# Altium schematic sheet dmpro16-pcb-v1-MCU-GPIO.SchDoc
size A4; DocumentNumber: 12; SheetNumber: 12; SheetTotal: 17; SheetName: MCU-GPIO
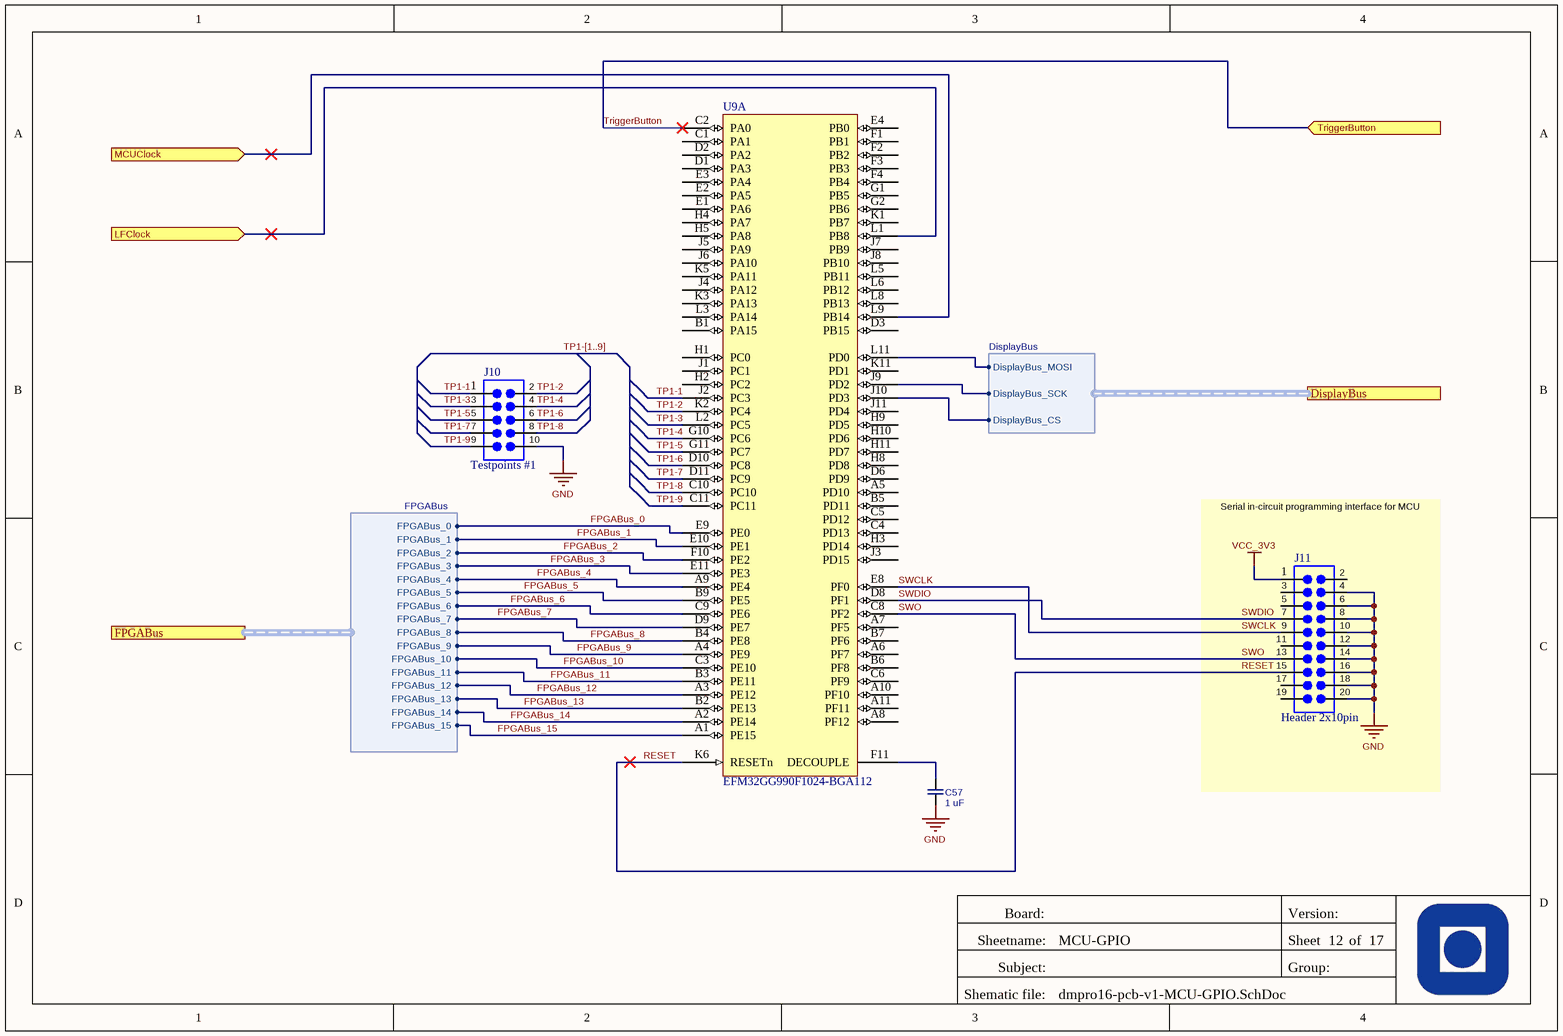
[diagram p0: dmpro16-pcb-v1-MCU-GPIO.SchDoc]

## Parts
C57  1 uF  [CAPC2012_0h50]
J10  Testpoints #1  [HEADER_2X5]
J11  Header 2x10pin  [HEADER_2X10]
U9  EFM32GG990F1024-BGA112  [ENMR-BGA112]  (part A of 2)

## Ports
DisplayBus (harness DisplayBus), FPGABus (harness FPGABus), LFClock (in), MCUClock (in), TriggerButton (in)

## Harnesses
DisplayBus: DisplayBus_MOSI, DisplayBus_SCK, DisplayBus_CS
FPGABus: FPGABus_0, FPGABus_1, FPGABus_2, FPGABus_3, FPGABus_4, FPGABus_5, FPGABus_6, FPGABus_7, FPGABus_8, FPGABus_9, FPGABus_10, FPGABus_11, FPGABus_12, FPGABus_13, FPGABus_14, FPGABus_15

## Nets
GND: C57.1 J10.10 J11.4 J11.6 J11.8 J11.10 J11.12 J11.14 J11.16 J11.18 J11.20
VCC_3V3: J11.1
FPGABus_0: U9.E9(PE0) ; port FPGABus.FPGABus_0
FPGABus_1: U9.E10(PE1) ; port FPGABus.FPGABus_1
FPGABus_2: U9.F10(PE2) ; port FPGABus.FPGABus_2
FPGABus_3: U9.E11(PE3) ; port FPGABus.FPGABus_3
FPGABus_4: U9.A9(PE4) ; port FPGABus.FPGABus_4
FPGABus_5: U9.B9(PE5) ; port FPGABus.FPGABus_5
FPGABus_6: U9.C9(PE6) ; port FPGABus.FPGABus_6
FPGABus_7: U9.D9(PE7) ; port FPGABus.FPGABus_7
FPGABus_8: U9.B4(PE8) ; port FPGABus.FPGABus_8
FPGABus_9: U9.A4(PE9) ; port FPGABus.FPGABus_9
FPGABus_10: U9.C3(PE10) ; port FPGABus.FPGABus_10
FPGABus_11: U9.B3(PE11) ; port FPGABus.FPGABus_11
FPGABus_12: U9.A3(PE12) ; port FPGABus.FPGABus_12
FPGABus_13: U9.B2(PE13) ; port FPGABus.FPGABus_13
FPGABus_14: U9.A2(PE14) ; port FPGABus.FPGABus_14
FPGABus_15: U9.A1(PE15) ; port FPGABus.FPGABus_15
LFClock: U9.L1(PB8) ; port LFClock
MCUClock: U9.L9(PB14) ; port MCUClock
RESET: J11.15 U9.K6(RESETn)
SWCLK: J11.9 U9.E8(PF0)
SWDIO: J11.7 U9.D8(PF1)
SWO: J11.13 U9.C8(PF2)
TP1-1: J10.1 U9.J2(PC3)
TP1-2: J10.2 U9.K2(PC4)
TP1-3: J10.3 U9.L2(PC5)
TP1-4: J10.4 U9.G10(PC6)
TP1-5: J10.5 U9.G11(PC7)
TP1-6: J10.6 U9.D10(PC8)
TP1-7: J10.7 U9.D11(PC9)
TP1-8: J10.8 U9.C10(PC10)
TP1-9: J10.9 U9.C11(PC11)
TriggerButton: U9.C2(PA0) ; port TriggerButton
NetC57_2: C57.2 U9.F11(DECOUPLE)
NetU9_J9: U9.J9(PD2) ; port DisplayBus.DisplayBus_SCK
NetU9_J10: U9.J10(PD3) ; port DisplayBus.DisplayBus_CS
NetU9_L11: U9.L11(PD0) ; port DisplayBus.DisplayBus_MOSI

Not connected (* = marked no-connect by the designer): J11 2 3 5 11 17 19; U9 A5(PD10) A6(PF7) A7(PF5) A8(PF12) A10(PF10) A11(PF11) B1(PA15) B5(PD11) B6(PF8) B7(PF6) C1(PA1) C4(PD13) C5(PD12) C6(PF9) D1(PA3) D2(PA2) D3(PB15) D6(PD9) E1(PA6) E2(PA5) E3(PA4) E4(PB0) F1(PB1) F2(PB2) F3(PB3) F4(PB4) G1(PB5) G2(PB6) H1(PC0) H2(PC2) H3(PD14) H4(PA7) H5(PA8) H8(PD8) H9(PD5) H10(PD6) H11(PD7) J1(PC1) J3(PD15) J4(PA12) J5(PA9) J6(PA10) J7(PB9) J8(PB10) J11(PD4) K1(PB7) K3(PA13) K5(PA11) K11(PD1) L3(PA14) L5(PB11) L6(PB12) L8(PB13)

## Buses and harness runs
bus TP1-[1..9]

## Notes on the sheet
- (near J11) Serial in-circuit programming interface for MCU
- Board:
- Version:
- Sheetname:
- Subject:
- Group:
- Sheet
- of
- Shematic file:

## Library data of the parts
C57 = cap_unpol_1608_1uF: 1 uF unpolarized capacitor (1608 size); Voltage Rating: 6.3 V; Body Size (metric): 1608; Ideal Value: 1 uF
J10 = con_head_2x05pin: Header 2x05pin
J11 = con_head_2x10pin
U9 = EFM32GG990F1024-BGA112: EFM32 Giant Gecko, M3 ARM Cortex CPU, 1024 KB Flash, 128 KB RAM, 1.85 - 3.8 V Supply, 48 MHz Max Speed, -40 to 85 degC, 112-Pin BGA, RoHS Compliant; Flash (KB): 1024; GPIO: 87; LCD: 8x34; LESENSE: Y; Max Speed (MHz): 48; OPAMPS: 3; RAM (KB): 128; DatasheetVersion: Rev 1.00; PackageVersion: Rev. 97SPP01315A_X03_06Jun11; PackageReference: BGA112; PackageDescription: 112-Pin Ball Grid Array, Body 10 x 10 mm, Pitch 0.8 mm; Supplier 1: Digi-Key; Supplier Part Number 1: 914-1051-2-ND; Supplier 2: Digi-Key; Supplier Part Number 2: 914-1051-1-ND; Supplier 3: Digi-Key; Supplier Part Number 3: 914-1051-6-ND; Supplier 4: Mouser; Supplier Part Number 4: 904-EFM32GG990F1024; ARM Cortex CPU: M3; Subcategory: EFM32 Giant Gecko; Supply Voltage (V): 1.85 - 3.8; USB: Y; Mounting Technology: Surface Mount; Generic Part Number: EFM32GG990; PartNumber: EFM32GG990F1024-BGA112; ComponentLink1Description: Manufacturer URL; ComponentLink1URL: http://www.energymicro.com/; ComponentLink2Description: Datasheet; ComponentLink2URL: http://cdn.energymicro.com/dl/devices/pdf/d0046_efm32gg990_datasheet.pdf; ComponentLink3Description: Package Specification; ComponentLink3URL: http://cdn.energymicro.com/dl/devices/pdf/d0007_efm32g290_datasheet.pdf